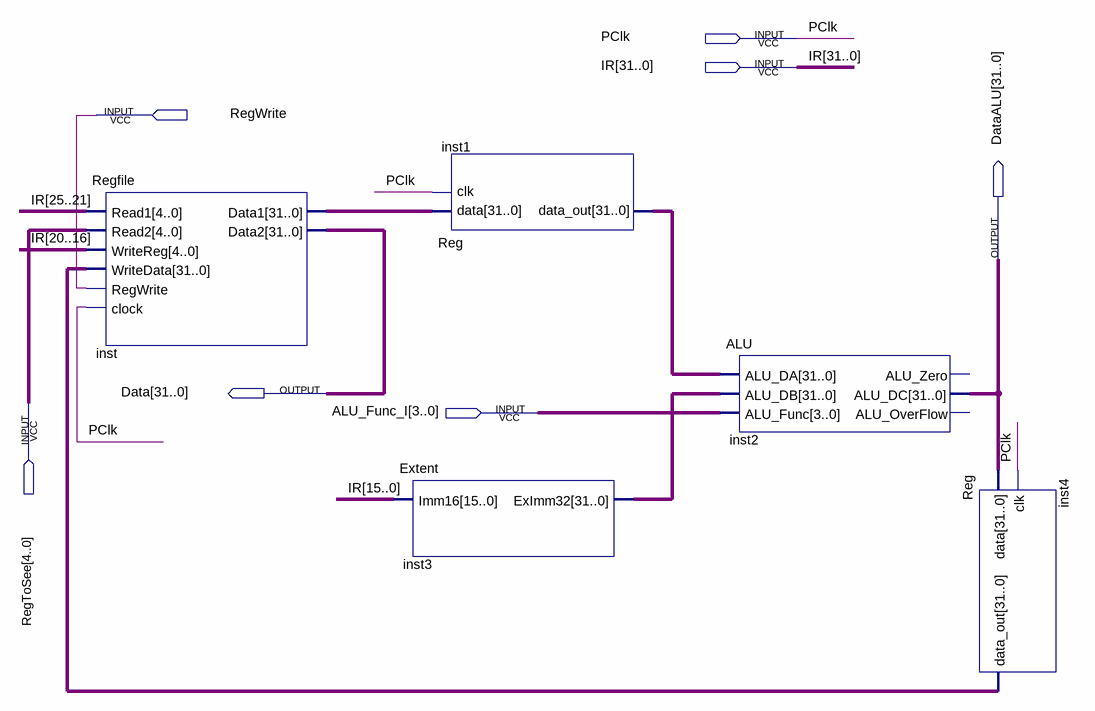
[diagram p0: schematic sheet]
// Quartus schematic I.bdf as structural Verilog: 5 symbols, 7 pins
module I (
  input  PClk,
  input  [31:0] IR,
  input  RegWrite,
  input  [4:0] RegToSee,
  input  [3:0] ALU_Func_I,
  output [31:0] DataALU,
  output [31:0] Data
);

  wire [31:0] inst1_data_out, inst3_eximm32, inst4_data_out, inst_data1;

  Regfile inst (
    .Read1(IR[25:21]), .Read2(RegToSee), .WriteReg(IR[20:16]), .WriteData(inst4_data_out),
    .RegWrite(RegWrite), .clock(PClk), .Data1(inst_data1), .Data2(Data));
  Extent inst3 (.Imm16(IR[15:0]), .ExImm32(inst3_eximm32));
  Reg inst1 (.data(inst_data1), .clk(PClk), .data_out(inst1_data_out));
  ALU inst2 (
    .ALU_DA(inst1_data_out), .ALU_DB(inst3_eximm32), .ALU_Func(ALU_Func_I), .ALU_DC(DataALU));  // open: ALU_Zero, ALU_OverFlow
  Reg inst4 (.data(DataALU), .clk(PClk), .data_out(inst4_data_out));
endmodule
